# EAGLE design OMHT3 (EAGLE 5.11)
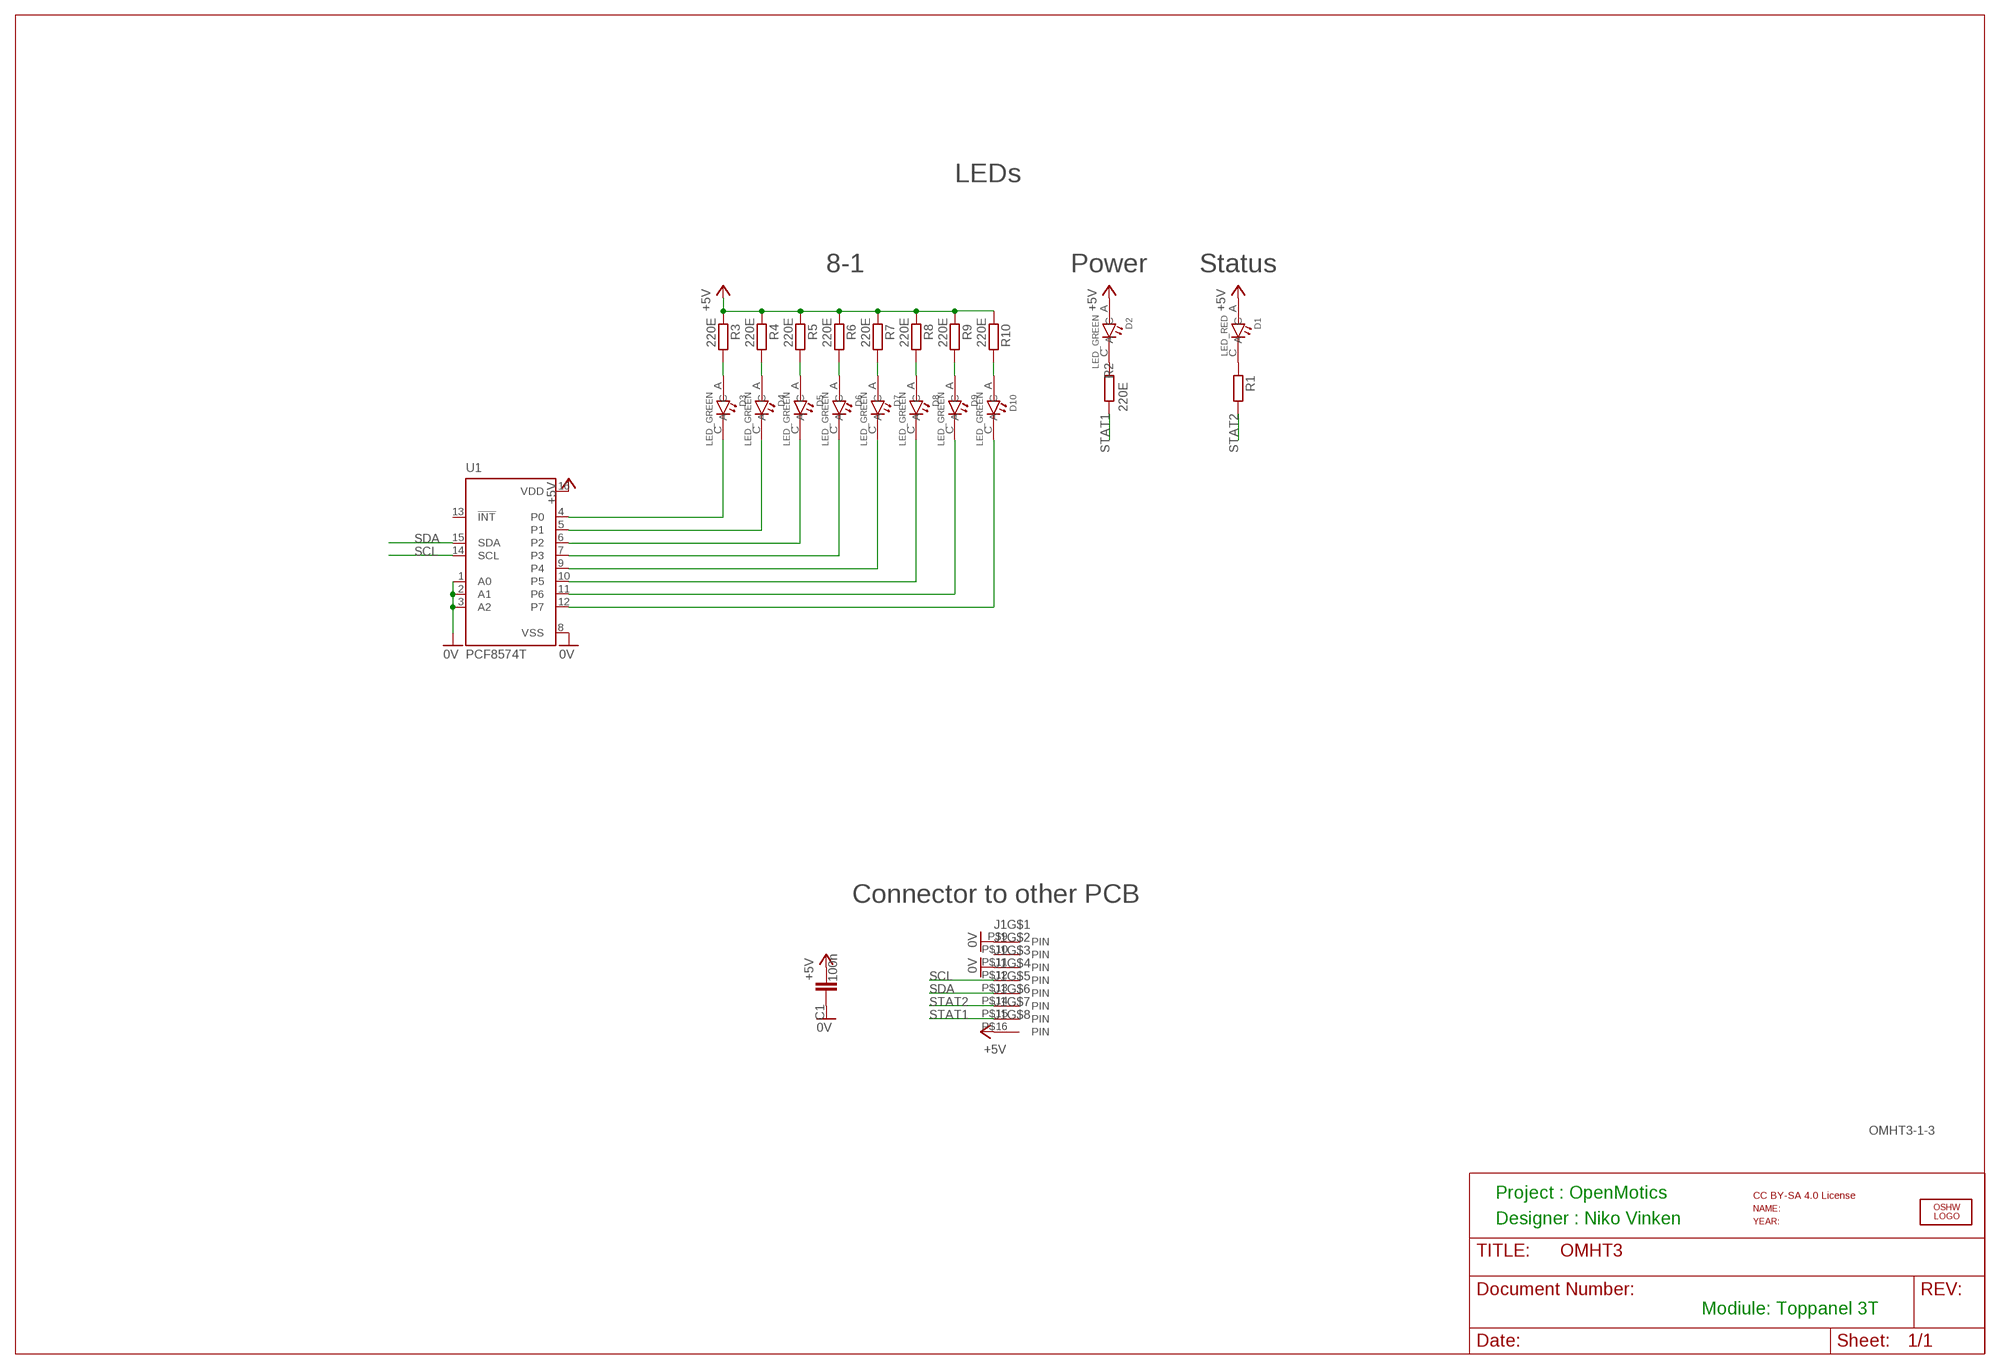
[diagram p0: schematic, sheet 1]

## Parts
C1  100n  C-EUC0603  [C0603]
D1  LED_RED  LED  [LED_BOTTOM]
D2  LED_GREEN  LED  [LED_BOTTOM]
D3  LED_GREEN  LED  [LED_BOTTOM]
D4  LED_GREEN  LED  [LED_BOTTOM]
D5  LED_GREEN  LED  [LED_BOTTOM]
D6  LED_GREEN  LED  [LED_BOTTOM]
D7  LED_GREEN  LED  [LED_BOTTOM]
D8  LED_GREEN  LED  [LED_BOTTOM]
D9  LED_GREEN  LED  [LED_BOTTOM]
D10  LED_GREEN  LED  [LED_BOTTOM]
J1  8PIN_CON_AMPSMD  [8PIN_CON_AMP_SMD]
LOGO2  OSHW_LOGO_FILLX0150-NT  [OSHW_FILLX150_NOTEXT]
OMHT3-1-3  LOGO_PCB  [LOGO_10MM]
R1  1K5  R-EU_R0603  [R0603]
R2  220E  R-EU_R0603  [R0603]
R3  220E  R-EU_R0603  [R0603]
R4  220E  R-EU_R0603  [R0603]
R5  220E  R-EU_R0603  [R0603]
R6  220E  R-EU_R0603  [R0603]
R7  220E  R-EU_R0603  [R0603]
R8  220E  R-EU_R0603  [R0603]
R9  220E  R-EU_R0603  [R0603]
R10  220E  R-EU_R0603  [R0603]
U1  PCF8574T  [SO16W]
U$5  CC_BY_SA  [CC_BY_SA]

## Nets
0V: C1.2 J1.P$9 J1.P$11 U1.1(A0) U1.2(A1) U1.3(A2) U1.8(VSS)
+5V: C1.1 D1.A D2.A J1.P$16 R3.1 R4.1 R5.1 R6.1 R7.1 R8.1 R9.1 R10.1 U1.16(VDD)
N$1: D2.C R2.1
N$2: D1.C R1.1
N$3: D3.A R3.2
N$4: D4.A R4.2
N$5: D5.A R5.2
N$6: D8.C U1.10(P5)
N$7: D7.C U1.9(P4)
N$8: D6.C U1.7(P3)
N$9: D5.C U1.6(P2)
N$10: D4.C U1.5(P1)
N$11: D3.C U1.4(P0)
N$12: D6.A R6.2
N$13: D7.A R7.2
N$14: D8.A R8.2
N$15: D9.A R9.2
N$16: D10.A R10.2
N$34: D10.C U1.12(P7)
N$60: D9.C U1.11(P6)
SCL: J1.P$12 U1.14(SCL)
SDA: J1.P$13 U1.15(SDA)
STAT1: J1.P$15 R2.2
STAT2: J1.P$14 R1.2
Unconnected: J1.P$10 U1.13(!INT)

## Notes on the sheet
- LEDs
- 8-1 | Power | Status
- Connector to other PCB
- Project : OpenMotics
- Designer : Niko Vinken
- Modiule: Toppanel 3T

## Library data of the parts
C1 = resistor:C-EU: CAPACITOR, European symbol
D1-D10 = OpenMotics:LED
J1 = OpenMotics:8PIN_CON_AMP
LOGO2 = ohw-logo:OSHW_LOGO_FILL
OMHT3-1-3 = OpenMotics:LOGO_PCB
R1-R10 = rcl:R-EU_: RESISTOR, European symbol
U1 = micro-philips:PCF8574: I2C-Bus Remote 8-bit I/O expander http://www.semiconductors.philips.com/acrobat_download/datasheets/PCF8574_4.pdf; MPN: PCF8574T/3,512; OC_FARNELL: 1201255; OC_NEWARK: 70R6870
U$5 = OpenMotics:CC_BY_SA

## Board
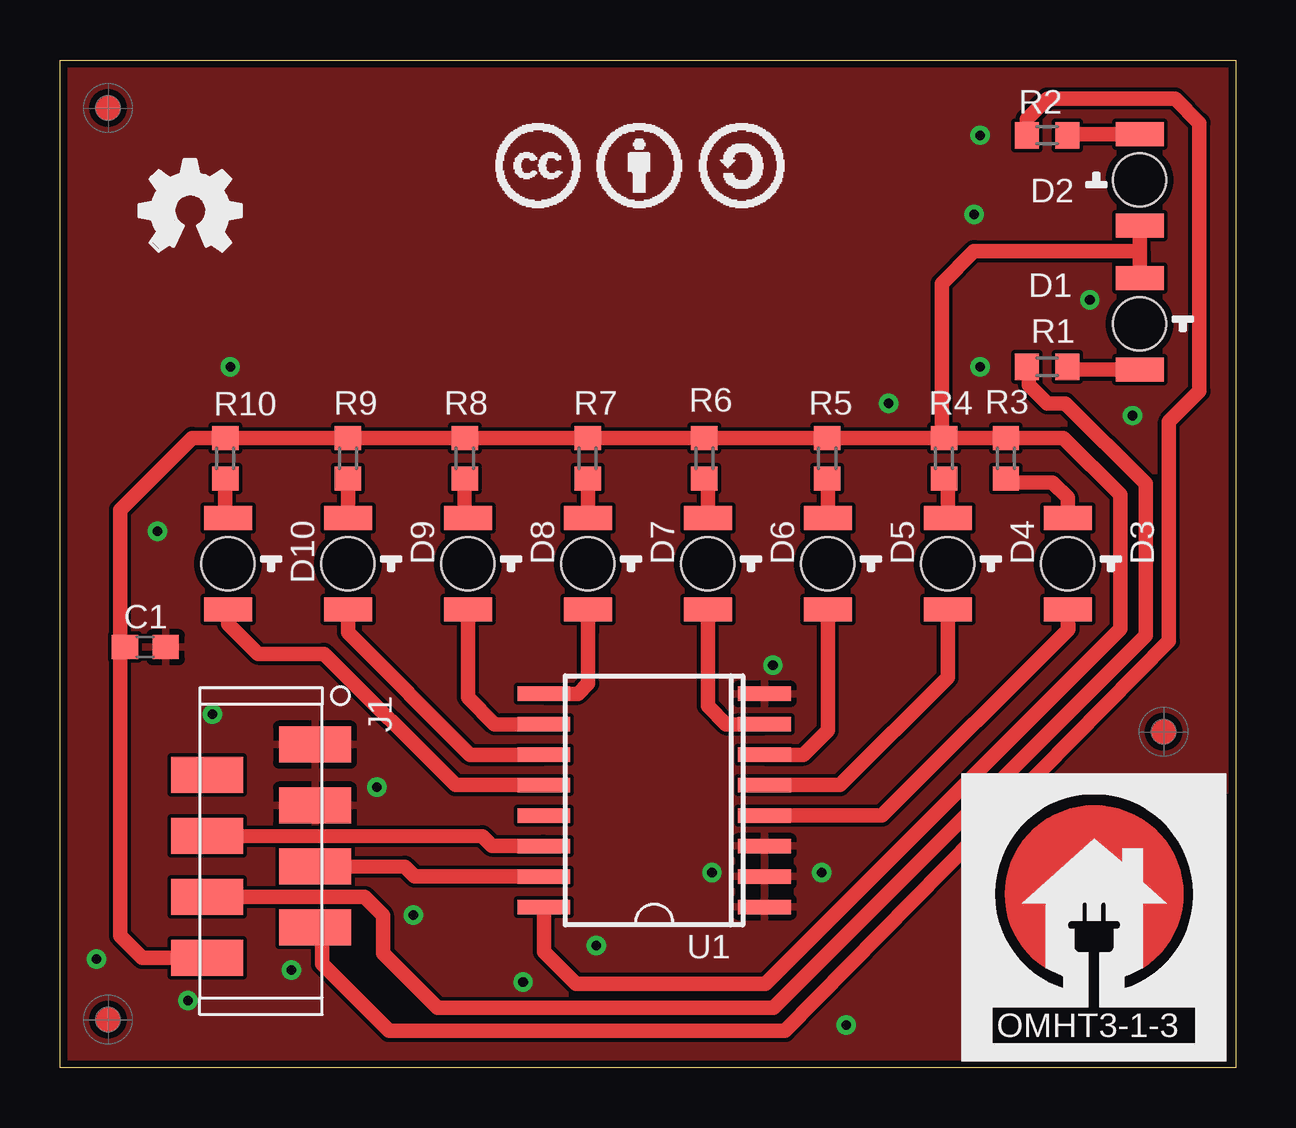
[diagram p1: board, top side]
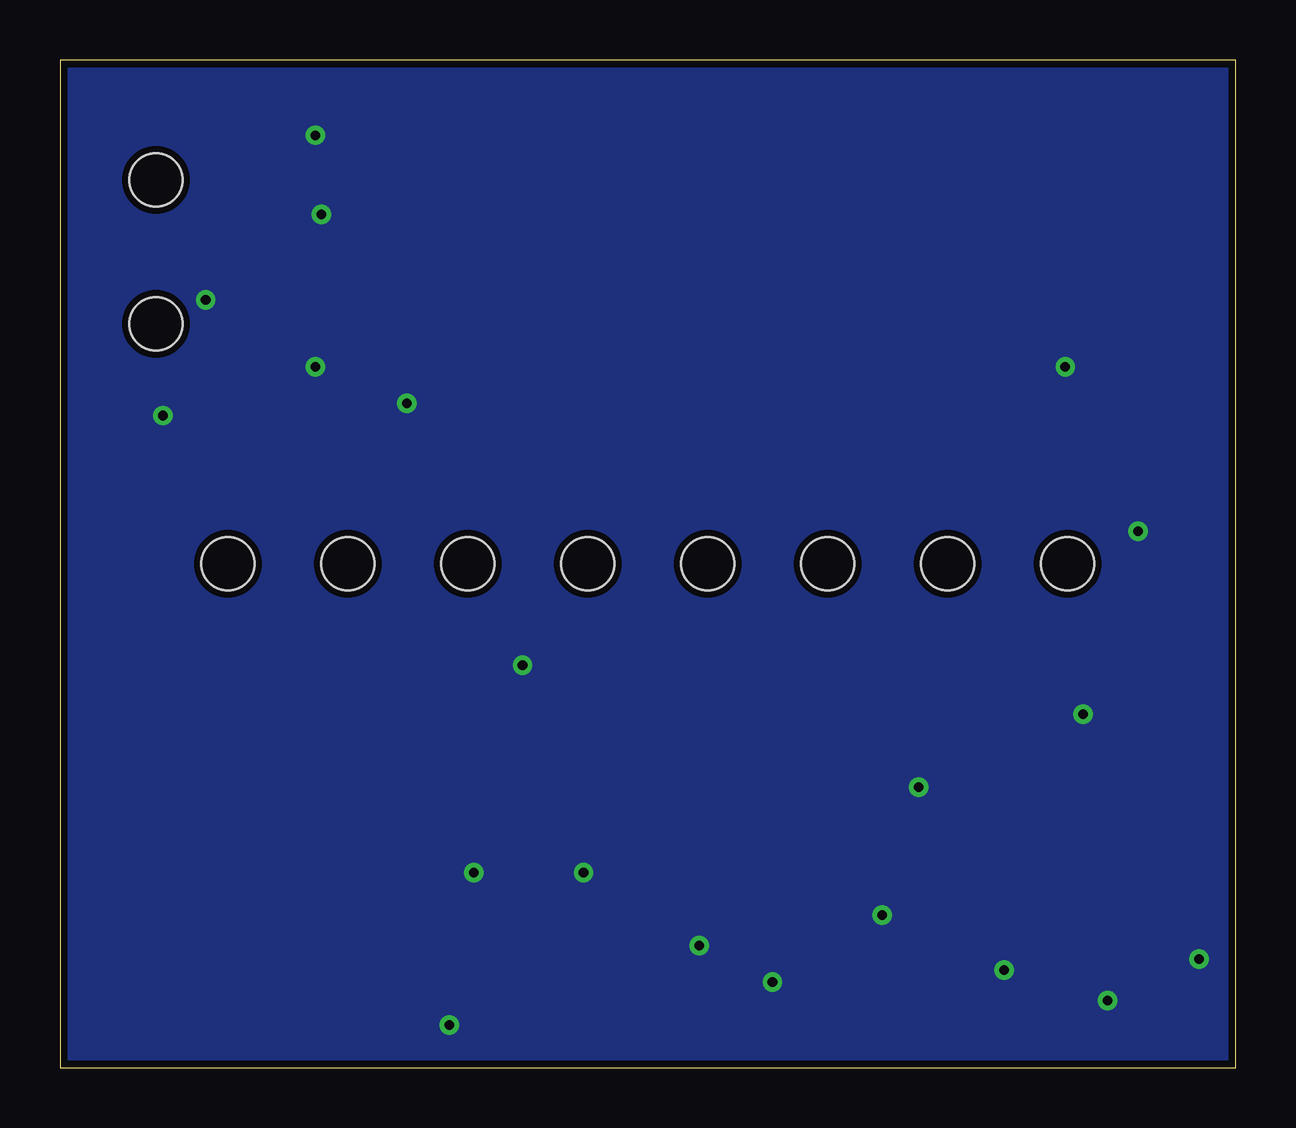
[diagram p2: board, bottom side, seen from below]

Size 49 x 42 mm. Coordinates in mm from the lower left corner, seen from the top.
Outline: 49,0 0,0 0,42 49,42 49,0
Copper layers (1+16): Top 0.035mm / dielectric 1.5mm / Bottom 0.035mm
Design rules "default *": minimum track width 10mil, minimum drill 24mil, track to track 6mil, track to pad 6mil, pad to pad 6mil, via to via 6mil, smd to smd 6mil, copper to edge 12mil, drill to drill 8mil, minimum pad ring 10mil, minimum via ring 8mil, stop-mask expansion 4mil, vias tented up to drill 16mil, thermal gap 10mil

### Footprints (pad centres in the part's own frame; a part is rotated, then mirrored left to right if it is on the bottom)
C0603 = smd 1.1 x 1: 1 -0.85,0; 2 0.85,0
LED_BOTTOM = smd 1 x 2: A -1.9,0; C 1.9,0 | hole 2.2: 0,0
8PIN_CON_AMP_SMD = smd 1.5 x 3: P$9 0,2.25; P$10 1.27,-2.25; P$11 2.54,2.25; P$12 3.81,-2.25; P$13 5.08,2.25; P$14 6.35,-2.25; P$15 7.62,2.25; P$16 8.89,-2.25
R0603 = smd 1 x 1.1: 1 -0.85,0; 2 0.85,0
SO16W = smd 0.6 x 2.2: 1 -4.445,-4.6; 2 -3.175,-4.6; 3 -1.905,-4.6; 4 -0.635,-4.6; 5 0.635,-4.6; 6 1.905,-4.6; 7 3.175,-4.6; 8 4.445,-4.6; 9 4.445,4.6; 10 3.175,4.6; 11 1.905,4.6; 12 0.635,4.6; 13 -0.635,4.6; 14 -1.905,4.6; 15 -3.175,4.6; 16 -4.445,4.6

### Placement (x,y rotation side)
C1  3.56,17.53 0 top
D1  45,31 270 top
D2  45,37 90 top
D3  42,21 270 top
D4  37,21 270 top
D5  32,21 270 top
D6  27,21 270 top
D7  22,21 270 top
D8  17,21 270 top
D9  12,21 270 top
D10  7,21 270 top
J1  8.38,13.46 270 top
LOGO2  3.3,34.04 0 top
OMHT3-1-3  37.59,0.25 0 top
R1  41.15,29.21 180 top
R2  41.15,38.86 180 top
R3  39.43,25.4 270 top
R4  36.85,25.4 270 top
R5  31.98,25.4 270 top
R6  26.86,25.4 270 top
R7  21.99,25.4 270 top
R8  16.87,25.4 270 top
R9  12.01,25.4 270 top
R10  6.89,25.4 270 top
U1  24.77,11.14 90 top
U$2  [FIDUCIAL_G10]  46,14 0 top
U$3  [FIDUCIAL_G10]  2,40 0 top
U$4  [FIDUCIAL_G10]  2,2 0 top
U$5  24.13,37.59 0 top

### Tracks (layer width: path | path; a pad name or v marks a point on that pad's centre or on a via)
0V  (via drill 0.4)
  other vias: 29.72,16.76 31.75,8.13 27.18,8.13 9.65,4.06 5.33,2.79 14.73,6.35 13.21,11.68 6.35,14.73 32.77,1.78 38.35,38.86 34.54,27.69 7.1,29.21 4.06,22.35 1.52,4.52 38.1,35.56 44.7,27.18 42.93,32 38.35,29.21 19.3,3.56 22.35,5.08
  pour Top: 0,0 37.68,0.25 37.68,7.96 41.29,11.58 48.77,11.58 48.85,41.91 0,41.91
  pour Bottom: 0,0 48.85,0 48.85,41.91 0,41.91
+5V
  Top 0.406: C1.1 2.5,17.53 2.5,18.29
  Top 0.61: R4.1 R5.1 R6.1 R7.1 R8.1 R9.1 R10.1 5.5,26.25 2.5,23.25 2.5,18.29 2.5,5.5 3.44,4.56 J1.P$16 | R4.1 R3.1 41.82,26.25 44.2,23.88 44.2,18.29 29.41,3.5 21.5,3.5 20.17,4.83 U1.16 | R4.1 36.75,26.35 36.75,32.69 38.1,34.04 45,34.04 | 45,34.04 D1.A | 45,34.04 D2.A
N$1
  Top 0.61: D2.C 42.04,38.9 R2.1
N$2
  Top 0.61: D1.C 42.11,29.1 R1.1
N$3
  Top 0.61: R3.2 39.62,24.38 41.37,24.38 42,23.75 D3.A
N$4
  Top 0.61: R4.2 37,24.4 D4.A
N$5
  Top 0.61: R5.2 32,24.53 D5.A
N$6
  Top 0.61: U1.10 18.12,14.31 17,15.43 D8.C
N$7
  Top 0.61: U1.9 21.59,15.58 22.01,16 22.01,18.22 22,18.23 D7.C
N$8
  Top 0.61: U1.7 27.77,14.31 27,15.08 D6.C
N$9
  Top 0.61: U1.6 30.99,13.04 32,14.05 D5.C
N$10
  Top 0.61: U1.5 32.52,11.77 37,16.26 D4.C
N$11
  Top 0.61: U1.4 34.27,10.5 42.03,18.27 42.01,18.77 42,18.25 D3.C
N$12
  Top 0.61: R6.2 27,24.41 D6.A
N$13
  Top 0.61: R7.2 D7.A
N$14
  Top 0.61: D8.A 16.87,23.03 R8.2
N$15
  Top 0.61: D9.A R9.2
N$16
  Top 0.61: D10.A 6.89,23.01 R10.2
N$34
  Top 0.61: U1.12 16.48,11.77 11,17.25 8.25,17.25 7,18.5 D10.C
N$60
  Top 0.61: U1.11 17.1,13.04 12,18.14 D9.C
SCL
  Top 0.61: J1.P$12 17.61,9.64 18,9.25 20.15,9.25 U1.14
SDA
  Top 0.61: U1.15 14.79,7.96 14.38,8.37 J1.P$13
STAT1
  Top 0.61: R2.2 40.3,39.54 41.15,40.39 46.48,40.39 47.5,39.37 47.5,28.19 46.23,26.92 46.23,17.78 30.23,1.52 13.72,1.52 10.92,4.32 10.92,5.55 J1.P$15
STAT2
  Top 0.61: J1.P$14 12.7,7.11 13.46,6.35 13.46,4.77 15.75,2.48 29.73,2.48 45.25,18 45.25,24.35 41.91,27.69 41.15,27.69 40.39,28.45 40.39,29.12 R1.2